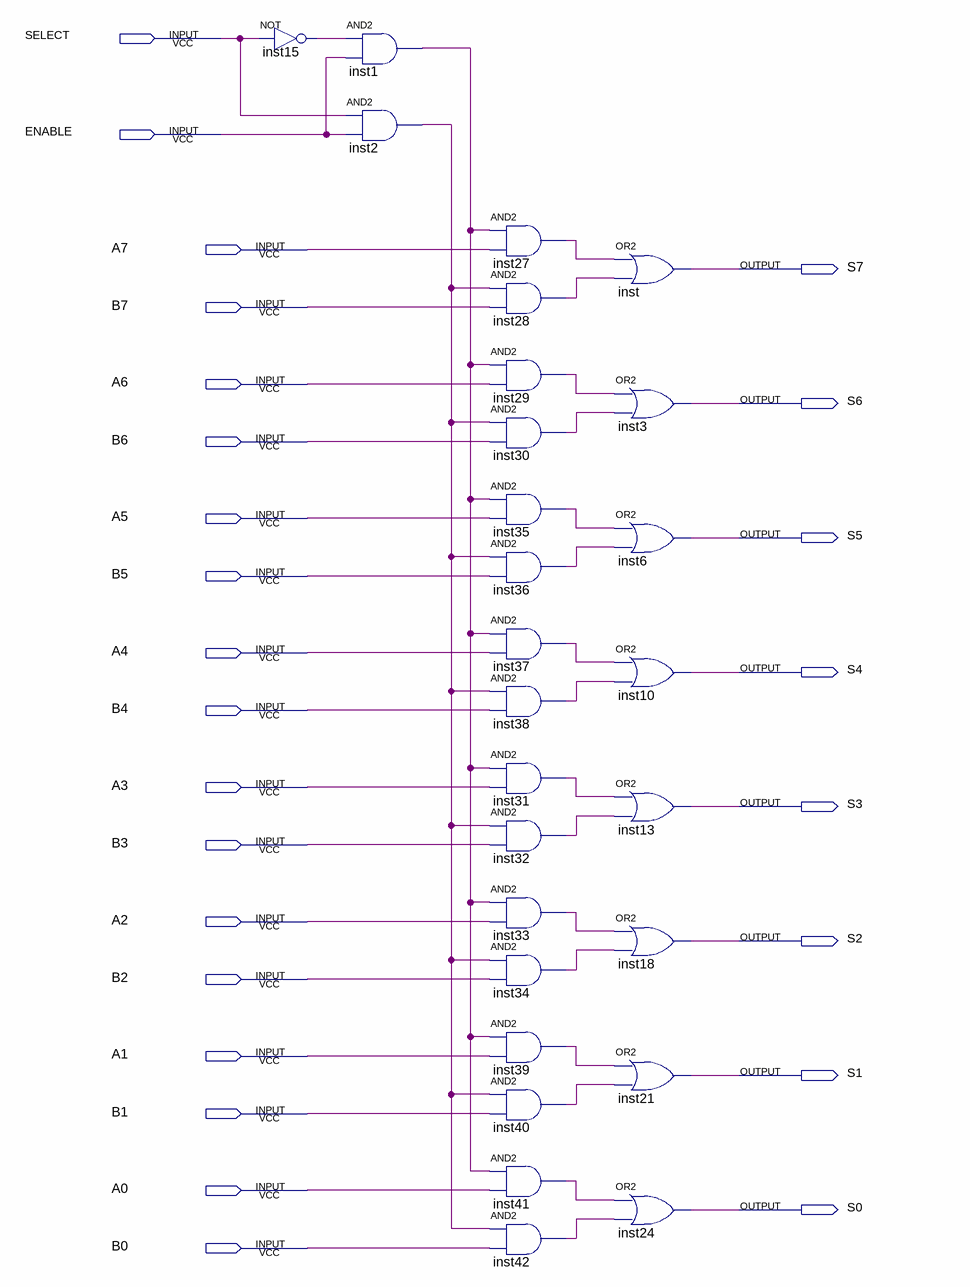
[diagram p0: schematic sheet]
// Quartus schematic MuxDuplode8bits.bdf as structural Verilog: 27 symbols, 26 pins
module MuxDuplode8bits (
  input  SELECT,
  input  ENABLE,
  input  A7,
  input  B7,
  input  A6,
  input  B6,
  input  A5,
  input  B5,
  input  A4,
  input  B4,
  input  A3,
  input  B3,
  input  A2,
  input  B2,
  input  A1,
  input  B1,
  input  A0,
  input  B0,
  output S7,
  output S6,
  output S5,
  output S4,
  output S3,
  output S2,
  output S1,
  output S0
);

  wire inst1_out, inst2_out, inst15_out, inst27_out, inst28_out, inst29_out, inst30_out, inst31_out,
       inst32_out, inst33_out, inst34_out, inst35_out, inst36_out, inst37_out, inst38_out, inst39_out,
       inst40_out, inst41_out, inst42_out;

  not inst15 (inst15_out, SELECT);
  and inst1 (inst1_out, inst15_out, ENABLE);
  and inst2 (inst2_out, SELECT, ENABLE);
  and inst27 (inst27_out, inst1_out, A7);
  and inst28 (inst28_out, inst2_out, B7);
  and inst29 (inst29_out, inst1_out, A6);
  and inst30 (inst30_out, inst2_out, B6);
  and inst35 (inst35_out, inst1_out, A5);
  and inst36 (inst36_out, inst2_out, B5);
  and inst37 (inst37_out, inst1_out, A4);
  and inst38 (inst38_out, inst2_out, B4);
  and inst31 (inst31_out, inst1_out, A3);
  and inst32 (inst32_out, inst2_out, B3);
  and inst33 (inst33_out, inst1_out, A2);
  and inst34 (inst34_out, inst2_out, B2);
  and inst39 (inst39_out, inst1_out, A1);
  and inst40 (inst40_out, inst2_out, B1);
  and inst41 (inst41_out, inst1_out, A0);
  and inst42 (inst42_out, inst2_out, B0);
  or inst (S7, inst27_out, inst28_out);
  or inst3 (S6, inst29_out, inst30_out);
  or inst6 (S5, inst35_out, inst36_out);
  or inst10 (S4, inst37_out, inst38_out);
  or inst13 (S3, inst31_out, inst32_out);
  or inst18 (S2, inst33_out, inst34_out);
  or inst21 (S1, inst39_out, inst40_out);
  or inst24 (S0, inst41_out, inst42_out);
endmodule
